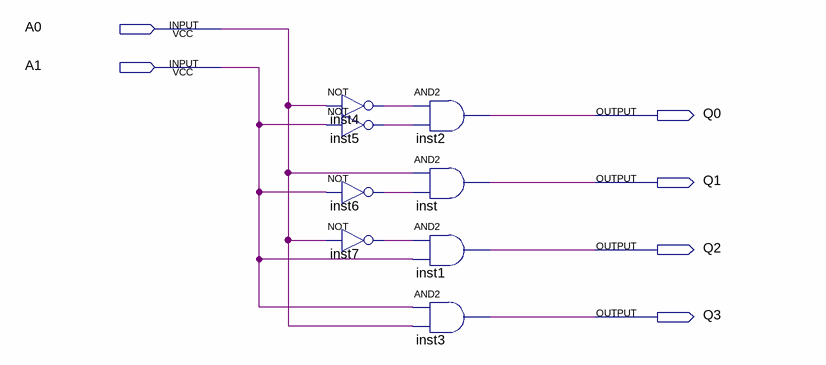
[diagram p0: schematic sheet]
// Quartus schematic DC_2input.bdf as structural Verilog: 8 symbols, 6 pins
module DC_2input (
  input  A0,
  input  A1,
  output Q0,
  output Q1,
  output Q2,
  output Q3
);

  wire inst4_out, inst5_out, inst6_out, inst7_out;

  not inst4 (inst4_out, A0);
  not inst5 (inst5_out, A1);
  not inst6 (inst6_out, A1);
  not inst7 (inst7_out, A0);
  and inst2 (Q0, inst4_out, inst5_out);
  and inst (Q1, A0, inst6_out);
  and inst1 (Q2, inst7_out, A1);
  and inst3 (Q3, A1, A0);
endmodule
